# Altium project EPotTP2Flyback.PrjPcb
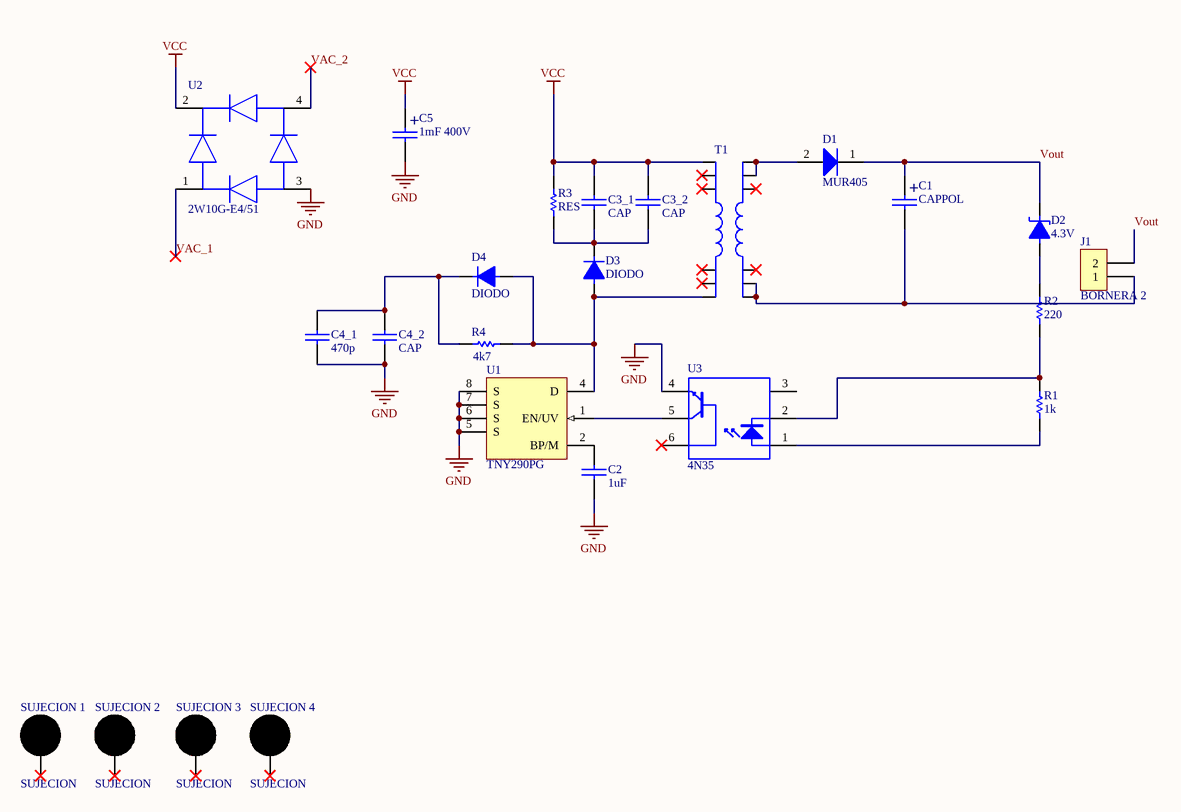
[diagram p0: flyback.SchDoc]
1 sheet, 24 parts. Net scope: global (net labels, ports and power ports of the same name join across sheets).
Board file: FlybackPCB.PcbDoc

## Sheet flyback.SchDoc
size A4; SheetNumber: 1; SheetTotal: 1

### Parts
C1  CAPPOL  [CAP300RP]
C2  1uF  [CAP100]
C3_1  CAP  [CAP100]
C3_2  CAP  [CAP100]
C4_1  470p  [CAP100]
C4_2  CAP  [CAP100]
C5  1mF 400V  [CAP300RP]
D1  MUR405  [ONSC-AXIAL_LEAD-2-267-05_V]
D2  4.3V  [DO41]
D3  DIODO  [DO41]
D4  DIODO  [DO41]
J1  BORNERA 2  [BORNERA2]
R1  1k  [RES400]
R2  220  [RES400]
R3  RES  [RES400]
R4  4k7  [RES300]
SUJECION_1  SUJECION  [SUJECION (5.00MM - 3.50MM)]
SUJECION_2  SUJECION  [SUJECION (5.00MM - 3.50MM)]
SUJECION_3  SUJECION  [SUJECION (5.00MM - 3.50MM)]
SUJECION_4  SUJECION  [SUJECION (5.00MM - 3.50MM)]
T1  Ferrite Core Epcos E 30/15/7  [Ferrite Core Epcos E 30_15_7-Footprint-1]  (value not drawn)
U1  TNY290PG  [PI-DIP-8C-7]
U2  2W10G-E4/51  [FP-WOG-MFG]
U3  4N35  [LTST-DIP-6_A]

### Nets
GND: C2.1 C4_1.1 C4_2.1 C5.2 U1.5(S) U1.6(S) U1.7(S) U1.8(S) U2.3(-) U3.4(E)
VCC: C3_1.1 C3_2.1 C5.1 R3.2 T1.1_1 U2.2(+)
VAC_1: U2.1(1_~)
VAC_2: U2.4(2_~)
Vout: C1.1 D1.1(K) D2.2 J1.2
NetC1_2: C1.2 J1.1 T1.2_5 T1.2_6
NetC2_2: C2.2 U1.2(BP/M)
NetC3_1_2: C3_1.2 C3_2.2 D3.2 R3.1
NetC4_1_2: C4_1.2 C4_2.2 D4.2 R4.2
NetD1_2: D1.2(A) T1.2_1 T1.2_2
NetD2_1: D2.1 R2.2
NetD3_1: D3.1 D4.1 R4.1 T1.1_6 U1.4(D)
NetR1_1: R1.1 U3.1(A)
NetR1_2: R1.2 R2.1 U3.2(C)
NetU1_1: U1.1(EN/UV) U3.5(C)

Not connected (* = marked no-connect by the designer): SUJECION_1 1*; SUJECION_2 1*; SUJECION_3 1*; SUJECION_4 1*; T1 1_2* 1_3* 1_4* 1_5* 2_3* 2_4*; U3 3(NC) 6(B)*

### Notes on the sheet
- (in symbol CAPPOL) +

### Library data of the parts
C2 C4_1 = CAP
C5 = CAPPOL
D1 = CMP-0902-00022-1: SWITCHMODE(TM) Power Rectifier, 2-Pin Axial_Lead, Pb-Free, Bulk Bag; Manufacturer: On Semiconductor; Type: Ultrafast; VRRM Max (V): 50; IFSM Max (A): 125; PartNumber: MUR405; PackageReference: AXIAL_LEAD-2-267-05; ComponentLink2Description: Datasheet; DatasheetVersion: Rev. 15; ComponentLink1URL: http://www.onsemi.com/; ComponentLink1Description: Manufacturer URL; Mounting Technology: Through Hole; ComponentLink2URL: http://www.onsemi.cn/pub_link/Collateral/MUR420-D.PDF; ComponentLink3Description: Package Specification; RoHS: TRUE; Packing: Bulk Bag; ComponentLink3URL: http://www.onsemi.com/pub_link/Collateral/267-05.PDF; PackageDescription: 2-Pin, Axial Lead, Diameter 5.05 mm; PackageVersion: Rev. G, 06/2000
D2 = DIODO ZENER
R1 R2 R4 = RES
T1 = CMP-012-00000-4: Ferrite Core E Core 30mm 7.3mm 15.2mm General Application
U1 = CMP-2000-05302-1: Energy-Efficient, Off-Line Switcher with Enhanced Flexibility and Extended Power Range, 23.5 W, -40 to 150 degC, 7-Pin DIP-8C, Pb-Free; Manufacturer: PowerIntegrations; Number of Outputs: 1Output; Input / Supply Voltage - Max: 265VAC; Duty Cycle - Max: 65%; Input / Supply Voltage - Min: 85VAC; Unit Weight: 0.080001oz; Output Power: 18W; Operating Supply Current: 365uA; Output Voltage: 12V; Switching Frequency: 132kHz; Series: TNY277; Manufacturer URL: https://www.power.com/; RoHS: True; Packaging: Tube; Type: OffLineSwitcher; Datasheet URL: http://www.mouser.com/ds/2/328/tny274-280-4065.pdf; Package / Case: DIP-8; Brand: PowerIntegrations; Mounting Style: ThroughHole; Tradename: TinySwitch; Operating Temperature Range: -40Cto+150C; Datasheet Version: Rev. I , 01/2009; Product Category: AC/DCConverters
U2 = CMP-02540-000015-1: BRIDGE RECT 1PHASE 1KV 2A WOG; Manufacturer: Vishay; Capacitance: 20pF; Value: 20pF; Peak Reverse Current: 5uA; Description: Bridge Rectifier Single Phase Standard 1kV Through Hole WOG; Max Repetitive Reverse Voltage: 1000V; Max Surge Forward Current: 60A; Max Junction Temp: +150°C; Lead Free: Yes; Temperature Range High: +150°C; Automotive: No; Mouser Description: Bridge Rectifiers 2.0 Amp 1000 Volt; Package: WOG; Category: Diode; Device Class L2: Diodes; RoHS: TRUE; Forward Current: 2A; Device Class L1: Discrete Semiconductors; Device Class L3: Rectifier Diodes; Temperature Range Low: -55°C; Temperature: -55°C to +150°C; Reverse Voltage: 1000V; ComponentLink2Description: Datasheet; ComponentLink2URL: http://www.vishay.com/docs/88528/2w005g.pdf; Octopart: https://octopart.com/2w10g-e4%2F51-vishay-42173035; Manufacturer Part Number: 2W10G-E4/51; Digikey Description: BRIDGE RECT 1PHASE 1KV 2A WOG; Height: 5.6mm
U3 = CMP-2000-05615-1: Photocoupler - Phototransistor Output, 1500 Vrms, -55 to 100 degC, 6-Pin DIP, RoHS, Tube; Manufacturer: Vishay; Maximum Input Diode Current: 60mA; Output Type: DC; Maximum Collector Current: 100mA; Isolation Voltage: 5000Vrms; Maximum Power Dissipation: 70mW; Maximum Reverse Diode Voltage: 6V; Current Transfer Ratio: 50%; Number of Channels: 1Channel; Output Device: NPNPhototransistor; Brand: VishaySemiconductors; Maximum Forward Diode Voltage: 1.5V; Maximum Collector Emitter Voltage: 30V; RoHS: Details; Package Description: 6-Pin Double In-line Package, Body 7.3 x 6.5 mm, Pitch 2.54 mm; Product Category: TransistorOutputOptocouplers; Packaging: Tube; Manufacturer URL: http://www.us.liteon.com/; Minimum Operating Temperature: -55C; Package Reference: DIP-6; Input Type: DC; Datasheet Version: Rev. D, 12/2015; Datasheet URL: http://optoelectronics.liteon.com/upload/download/DS-70-99-0012/S_110_4N3X%20Series%201115.pdf; Maximum Operating Temperature: +100C; Package / Case: PDIP-6; Forward Current: 60mA; Configuration: 1Channel; Factory Pack Quantity: 3000; Number of Channels per Chip: 1Channel; Mounting Technology: ThroughHole